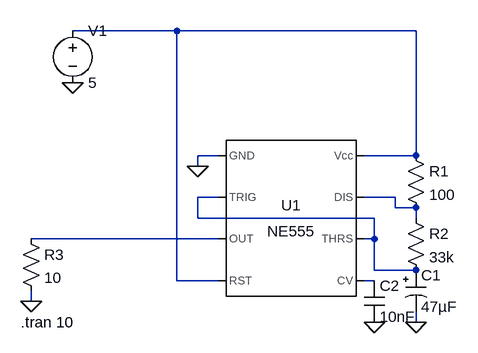
[diagram p0: schematic Draft2.asc]
Draft2.asc, the LTspice schematic file:
Version 4.1
SHEET 1 880 680
WIRE 16 -96 -144 -96
WIRE 384 -96 16 -96
WIRE 80 96 48 96
WIRE 384 96 384 -96
WIRE 384 96 304 96
WIRE 48 112 48 96
WIRE 80 160 48 160
WIRE 352 160 304 160
WIRE 352 176 352 160
WIRE 384 176 352 176
WIRE 48 192 48 160
WIRE 320 192 48 192
WIRE 384 192 384 176
WIRE 80 224 -208 224
WIRE 320 224 320 192
WIRE 320 224 304 224
WIRE 320 272 320 224
WIRE 384 272 320 272
WIRE 16 288 16 -96
WIRE 80 288 16 288
WIRE 320 288 304 288
WIRE -208 320 -208 304
WIRE 384 352 384 336
FLAG -208 320 0
FLAG -144 -16 0
FLAG 48 112 0
FLAG 320 352 0
FLAG 384 352 0
SYMBOL Misc\\NE555 192 192 R0
SYMATTR InstName U1
SYMBOL voltage -144 -112 R0
WINDOW 123 0 0 Left 0
WINDOW 39 0 0 Left 0
SYMATTR InstName V1
SYMATTR Value 5
SYMBOL res 368 80 R0
SYMATTR InstName R1
SYMATTR Value 100
SYMBOL res 368 176 R0
SYMATTR InstName R2
SYMATTR Value 33k
SYMBOL polcap 368 272 R0
SYMATTR InstName C1
SYMATTR Value 47µF
SYMBOL res -224 208 R0
SYMATTR InstName R3
SYMATTR Value 10
SYMBOL cap 304 288 R0
SYMATTR InstName C2
SYMATTR Value 10nF
TEXT -224 352 Left 2 !.tran 10

The netlist it stands for:
* Draft2.asc
X§U1 0 N002 N004 N001 N005 N002 N003 N001 NE555  ; pins GND TRIG OUT RST CV THRS DIS Vcc
V1 N001 0 5
R1 N001 N003 100
R2 N003 N002 33k
C1 N002 0 47µF
R3 N004 0 10
C2 N005 0 10nF
.tran 10
.lib NE555.sub
.backanno
.end